# EAGLE design TCO v1 (EAGLE 6.5.0)
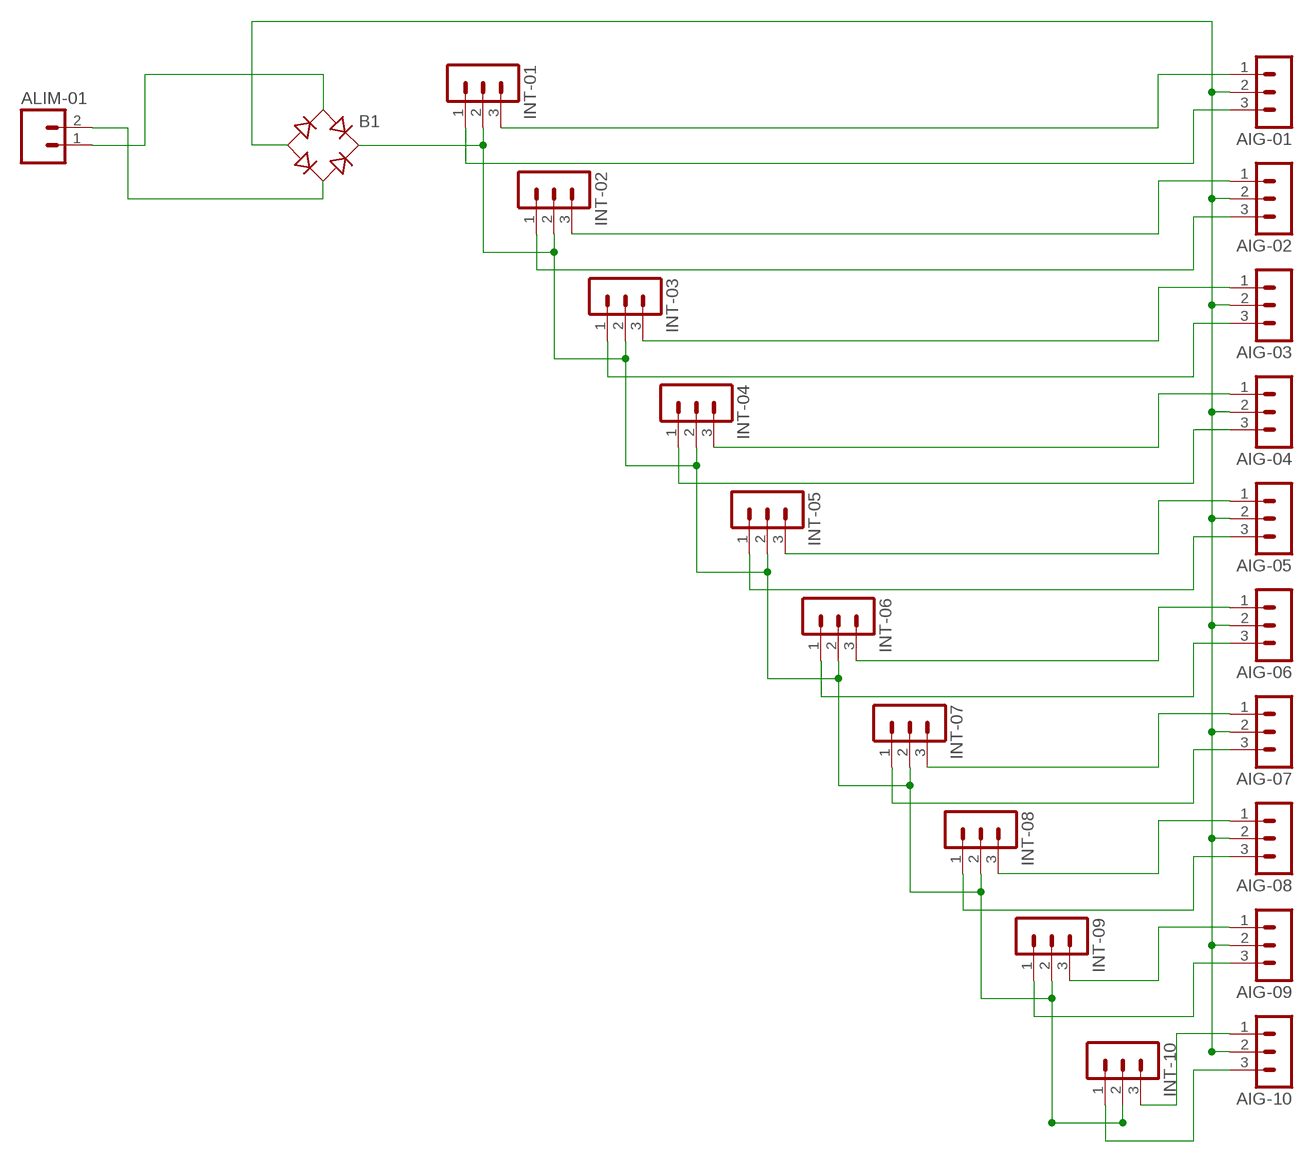
[diagram p0: schematic, sheet 1]

## Parts
AIG-01  MA03-1  [MA03-1]
AIG-02  MA03-1  [MA03-1]
AIG-03  MA03-1  [MA03-1]
AIG-04  MA03-1  [MA03-1]
AIG-05  MA03-1  [MA03-1]
AIG-06  MA03-1  [MA03-1]
AIG-07  MA03-1  [MA03-1]
AIG-08  MA03-1  [MA03-1]
AIG-09  MA03-1  [MA03-1]
AIG-10  MA03-1  [MA03-1]
ALIM-01  M02  [02P]
B1  B-DIL  [B-DIL]
INT-01  MA03-1  [MA03-1]
INT-02  MA03-1  [MA03-1]
INT-03  MA03-1  [MA03-1]
INT-04  MA03-1  [MA03-1]
INT-05  MA03-1  [MA03-1]
INT-06  MA03-1  [MA03-1]
INT-07  MA03-1  [MA03-1]
INT-08  MA03-1  [MA03-1]
INT-09  MA03-1  [MA03-1]
INT-10  MA03-1  [MA03-1]

## Nets
N$2: ALIM-01.1 B1.AC1
N$3: AIG-01.2 AIG-02.2 AIG-03.2 AIG-04.2 AIG-05.2 AIG-06.2 AIG-07.2 AIG-08.2 AIG-09.2 AIG-10.2 B1.-
N$4: AIG-01.3 INT-01.1
N$5: B1.+ INT-01.2 INT-02.2 INT-03.2 INT-04.2 INT-05.2 INT-06.2 INT-07.2 INT-08.2 INT-09.2 INT-10.2
N$6: AIG-01.1 INT-01.3
N$7: AIG-02.3 INT-02.1
N$8: AIG-02.1 INT-02.3
N$9: AIG-03.3 INT-03.1
N$10: AIG-03.1 INT-03.3
N$11: AIG-04.3 INT-04.1
N$12: AIG-04.1 INT-04.3
N$13: AIG-05.1 INT-05.3
N$14: AIG-05.3 INT-05.1
N$15: AIG-06.1 INT-06.3
N$16: AIG-06.3 INT-06.1
N$17: AIG-07.1 INT-07.3
N$18: AIG-07.3 INT-07.1
N$19: AIG-08.1 INT-08.3
N$20: AIG-08.3 INT-08.1
N$21: AIG-09.1 INT-09.3
N$22: AIG-09.3 INT-09.1
N$23: AIG-10.1 INT-10.3
N$24: AIG-10.3 INT-10.1
N$25: ALIM-01.2 B1.AC2

## Library data of the parts
AIG-01-AIG-09 AIG-10 INT-01-INT-09 INT-10 = con-lstb:MA03-1: PIN HEADER; OC_FARNELL: unknown; OC_NEWARK: unknown
ALIM-01 = con-amp-quick:M02: AMP QUICK CONNECTOR; OC_FARNELL: unknown; OC_NEWARK: unknown
B1 = rectifier:B-DIL: RECTIFIER

## Board
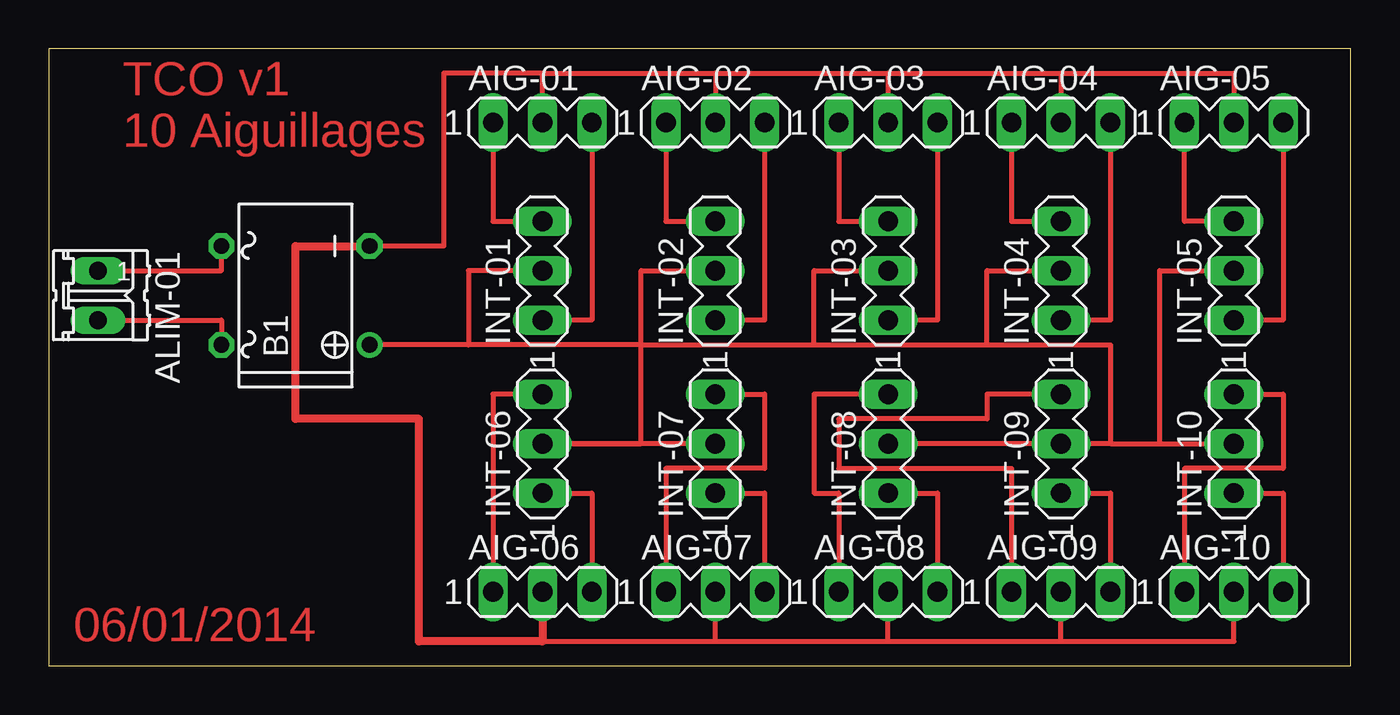
[diagram p1: board, top side]

Size 66.98 x 31.74 mm. Coordinates in mm from the lower left corner, seen from the top.
Outline: 0,0 66.98,0 66.98,31.74 0,31.74 0,0
Copper layers (1*16): Top 0.035mm / dielectric 1.5mm / Bottom 0.035mm
Design rules "default *": minimum track width 10mil, minimum drill 24mil, track to track 8mil, track to pad 8mil, pad to pad 8mil, via to via 8mil, smd to smd 8mil, copper to edge 40mil, drill to drill 8mil, minimum pad ring 10mil, minimum via ring 8mil, stop-mask expansion 4mil, vias tented up to drill 0mil, thermal gap 10mil

### Footprints (pad centres in the part's own frame; a part is rotated, then mirrored left to right if it is on the bottom)
MA03-1 = drill 1.016 long: 1 -2.54,0; 2 0,0; 3 2.54,0
02P = drill 0.914 long: 1 -1.27,0; 2 1.27,0
B-DIL = drill 0.813: + -2.54,-3.81 | drill 0.813 octagon: - 2.54,-3.81; AC1 2.54,3.81; AC2 -2.54,3.81

### Placement (x,y rotation side)
AIG-01  25.4,27.94 0 top
AIG-02  34.29,27.94 0 top
AIG-03  43.18,27.94 0 top
AIG-04  52.07,27.94 0 top
AIG-05  60.96,27.94 0 top
AIG-06  25.4,3.81 0 top
AIG-07  34.29,3.81 0 top
AIG-08  43.18,3.81 0 top
AIG-09  52.07,3.81 0 top
AIG-10  60.96,3.81 0 top
ALIM-01  2.54,19.05 270 top
B1  12.7,19.05 90 top
INT-01  25.4,20.32 90 top
INT-02  34.29,20.32 90 top
INT-03  43.18,20.32 90 top
INT-04  52.07,20.32 90 top
INT-05  60.96,20.32 90 top
INT-06  25.4,11.43 90 top
INT-07  34.29,11.43 90 top
INT-08  43.18,11.43 90 top
INT-09  52.07,11.43 90 top
INT-10  60.96,11.43 90 top

### Tracks (layer width: path | path; a pad name or v marks a point on that pad's centre or on a via)
N$2
  Top 0.254: B1.AC1 8.89,20.32 ALIM-01.1
N$3
  Top 0.254: B1.- 20.32,21.59 20.32,30.48 25.4,30.48 | AIG-01.2 25.4,30.48 | 34.29,30.48 AIG-02.2 | 25.4,30.48 34.29,30.48 | 43.18,30.48 AIG-03.2 | 34.29,30.48 43.18,30.48 | 52.07,30.48 AIG-04.2 | 43.18,30.48 52.07,30.48 | AIG-05.2 60.96,30.48 52.07,30.48 | 34.29,1.27 AIG-07.2 | 25.4,1.27 34.29,1.27 | 43.18,1.27 AIG-08.2 | 34.29,1.27 43.18,1.27 | 52.07,1.27 AIG-09.2 | 43.18,1.27 52.07,1.27 | AIG-10.2 60.96,1.27 52.07,1.27
  Top 0.406: AIG-06.2 25.4,1.27 19.05,1.27 19.05,12.7 12.7,12.7 12.7,21.59 B1.-
N$4
  Top 0.254: INT-01.1 27.94,17.78 AIG-01.3
N$5
  Top 0.254: INT-08.2 INT-09.2 54.61,11.43 | 54.61,11.43 57.15,11.43 | 57.15,11.43 INT-10.2 | INT-05.2 57.15,20.32 57.15,11.43 | 21.59,16.51 B1.+ | INT-01.2 21.59,20.32 21.59,16.51 | INT-07.2 INT-06.2 30.48,11.43 30.48,16.51 | 30.48,16.51 30.48,20.32 INT-02.2 | INT-03.2 39.37,20.32 39.37,16.51 | 30.48,16.51 39.37,16.51 | INT-04.2 48.26,20.32 48.26,16.51 | 39.37,16.51 48.26,16.51 | 30.48,16.51 21.59,16.51 | 54.61,11.43 54.61,16.51 48.26,16.51
N$6
  Top 0.254: INT-01.3 22.86,22.86 AIG-01.1
N$7
  Top 0.254: INT-02.1 36.83,17.78 AIG-02.3
N$8
  Top 0.254: INT-02.3 31.75,22.86 AIG-02.1
N$9
  Top 0.254: INT-03.1 45.72,17.78 AIG-03.3
N$10
  Top 0.254: INT-03.3 40.64,22.86 AIG-03.1
N$11
  Top 0.254: INT-04.1 54.61,17.78 AIG-04.3
N$12
  Top 0.254: INT-04.3 49.53,22.86 AIG-04.1
N$13
  Top 0.254: AIG-05.1 58.42,22.86 INT-05.3
N$14
  Top 0.254: INT-05.1 63.5,17.78 AIG-05.3
N$15
  Top 0.254: AIG-06.1 22.86,13.97 INT-06.3
N$16
  Top 0.254: AIG-06.3 27.94,8.89 INT-06.1
N$17
  Top 0.254: AIG-07.1 31.75,10.16 36.83,10.16 36.83,13.97 INT-07.3
N$18
  Top 0.254: AIG-07.3 36.83,8.89 INT-07.1
N$19
  Top 0.254: AIG-08.1 40.64,8.89 39.37,8.89 39.37,13.97 INT-08.3
N$20
  Top 0.254: AIG-08.3 45.72,8.89 INT-08.1
N$21
  Top 0.254: AIG-09.1 49.53,10.16 40.64,10.16 40.64,12.7 48.26,12.7 48.26,13.97 INT-09.3
N$22
  Top 0.254: AIG-09.3 54.61,8.89 INT-09.1
N$23
  Top 0.254: AIG-10.1 58.42,10.16 63.5,10.16 63.5,13.97 INT-10.3
N$24
  Top 0.254: AIG-10.3 63.5,8.89 INT-10.1
N$25
  Top 0.254: B1.AC2 8.89,17.78 ALIM-01.2

### Text on the board
Top: TCO v1 / 10 Aiguillages | 06/01/2014